# EAGLE board qc board V3 (EAGLE 9.6.1), part 1 of 3
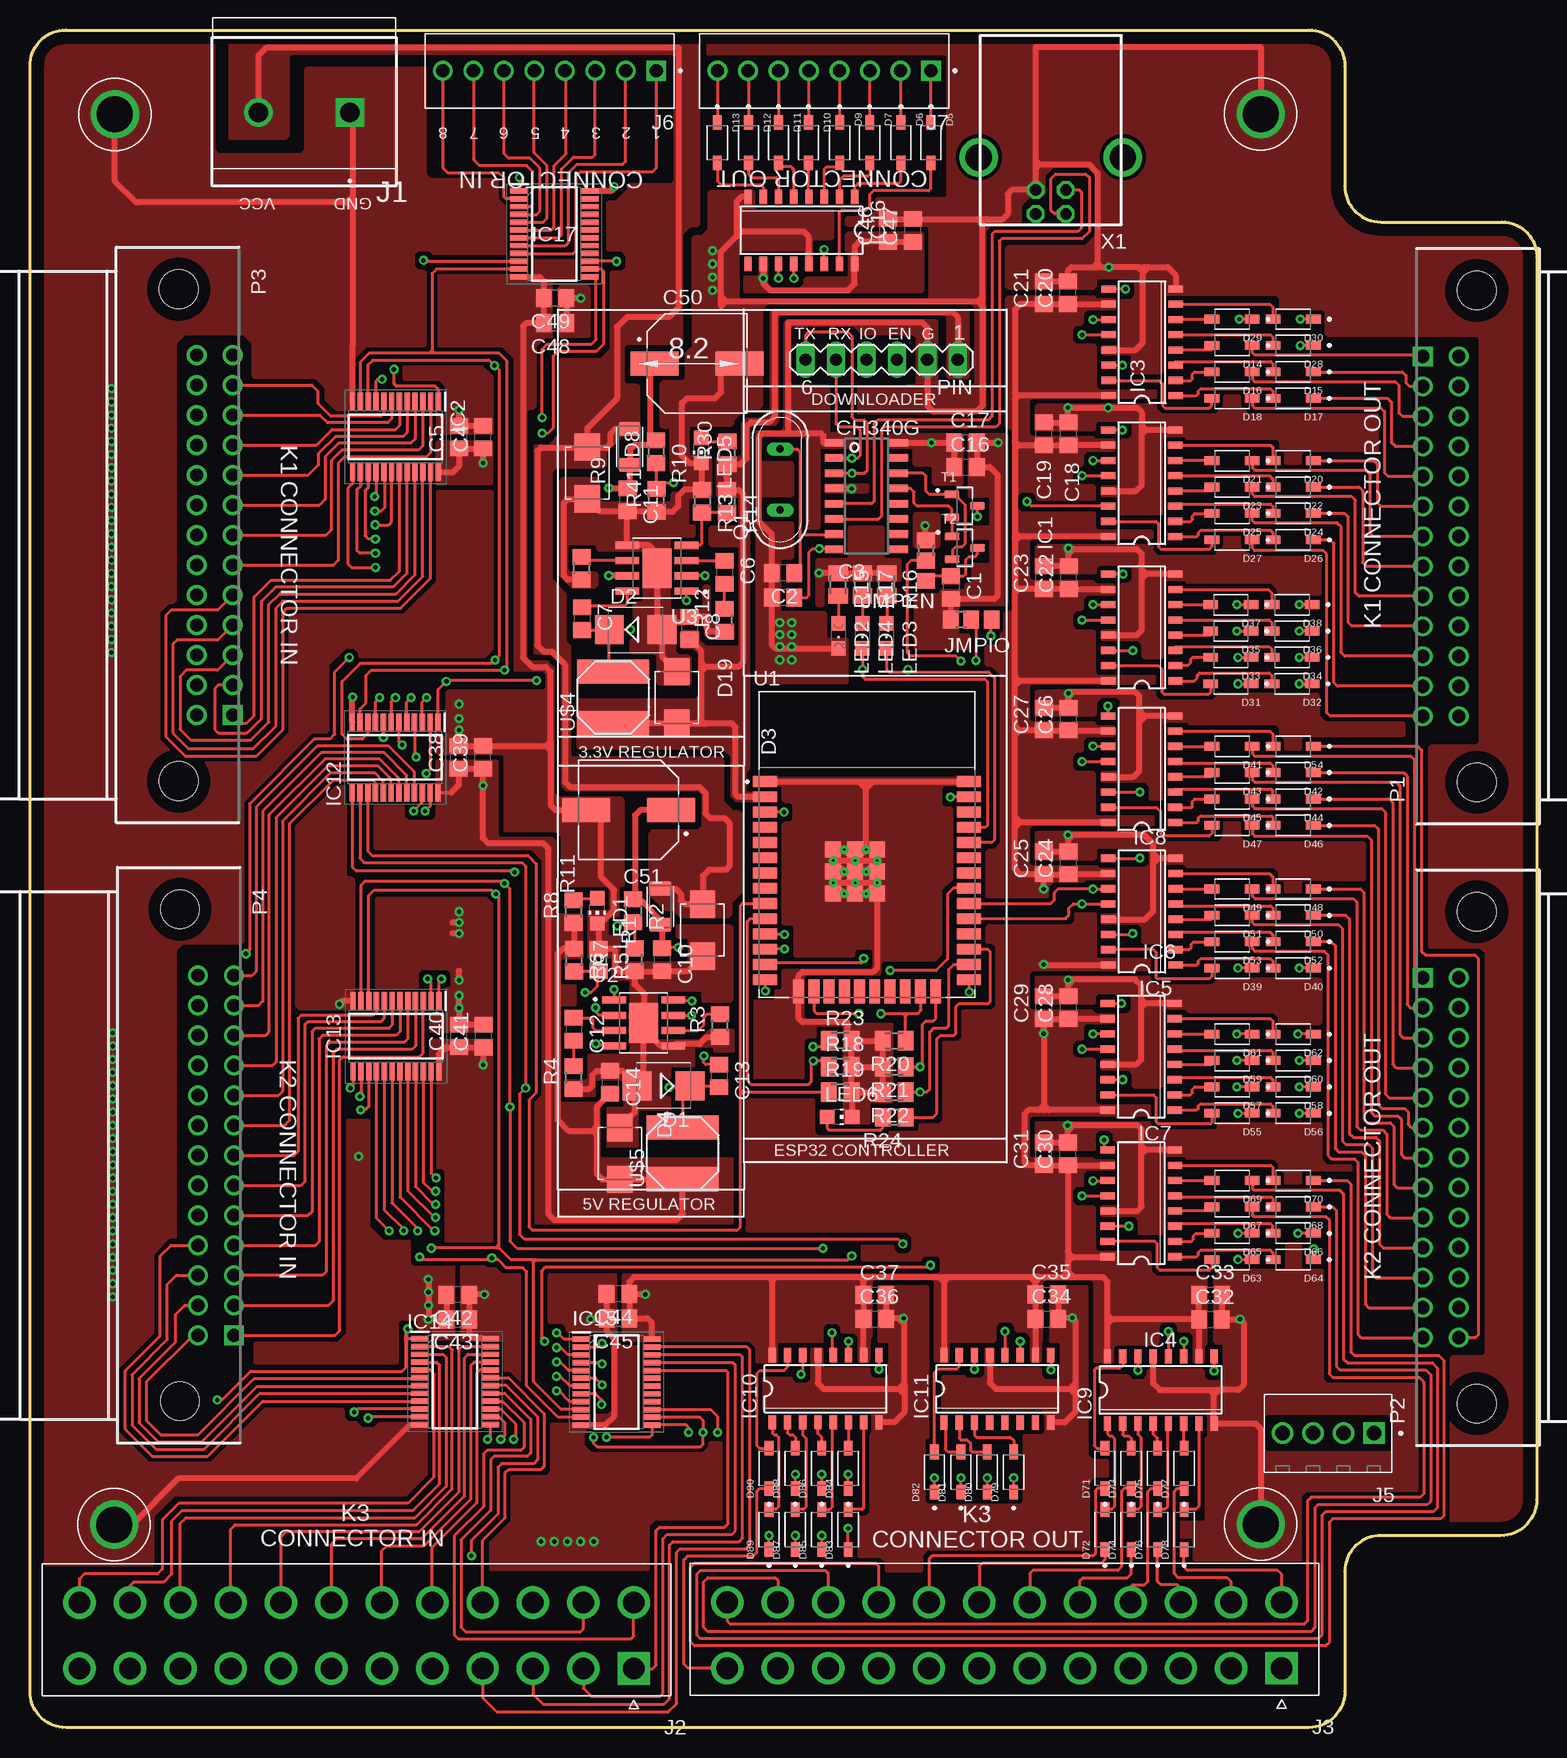
[diagram p1: board, top side]
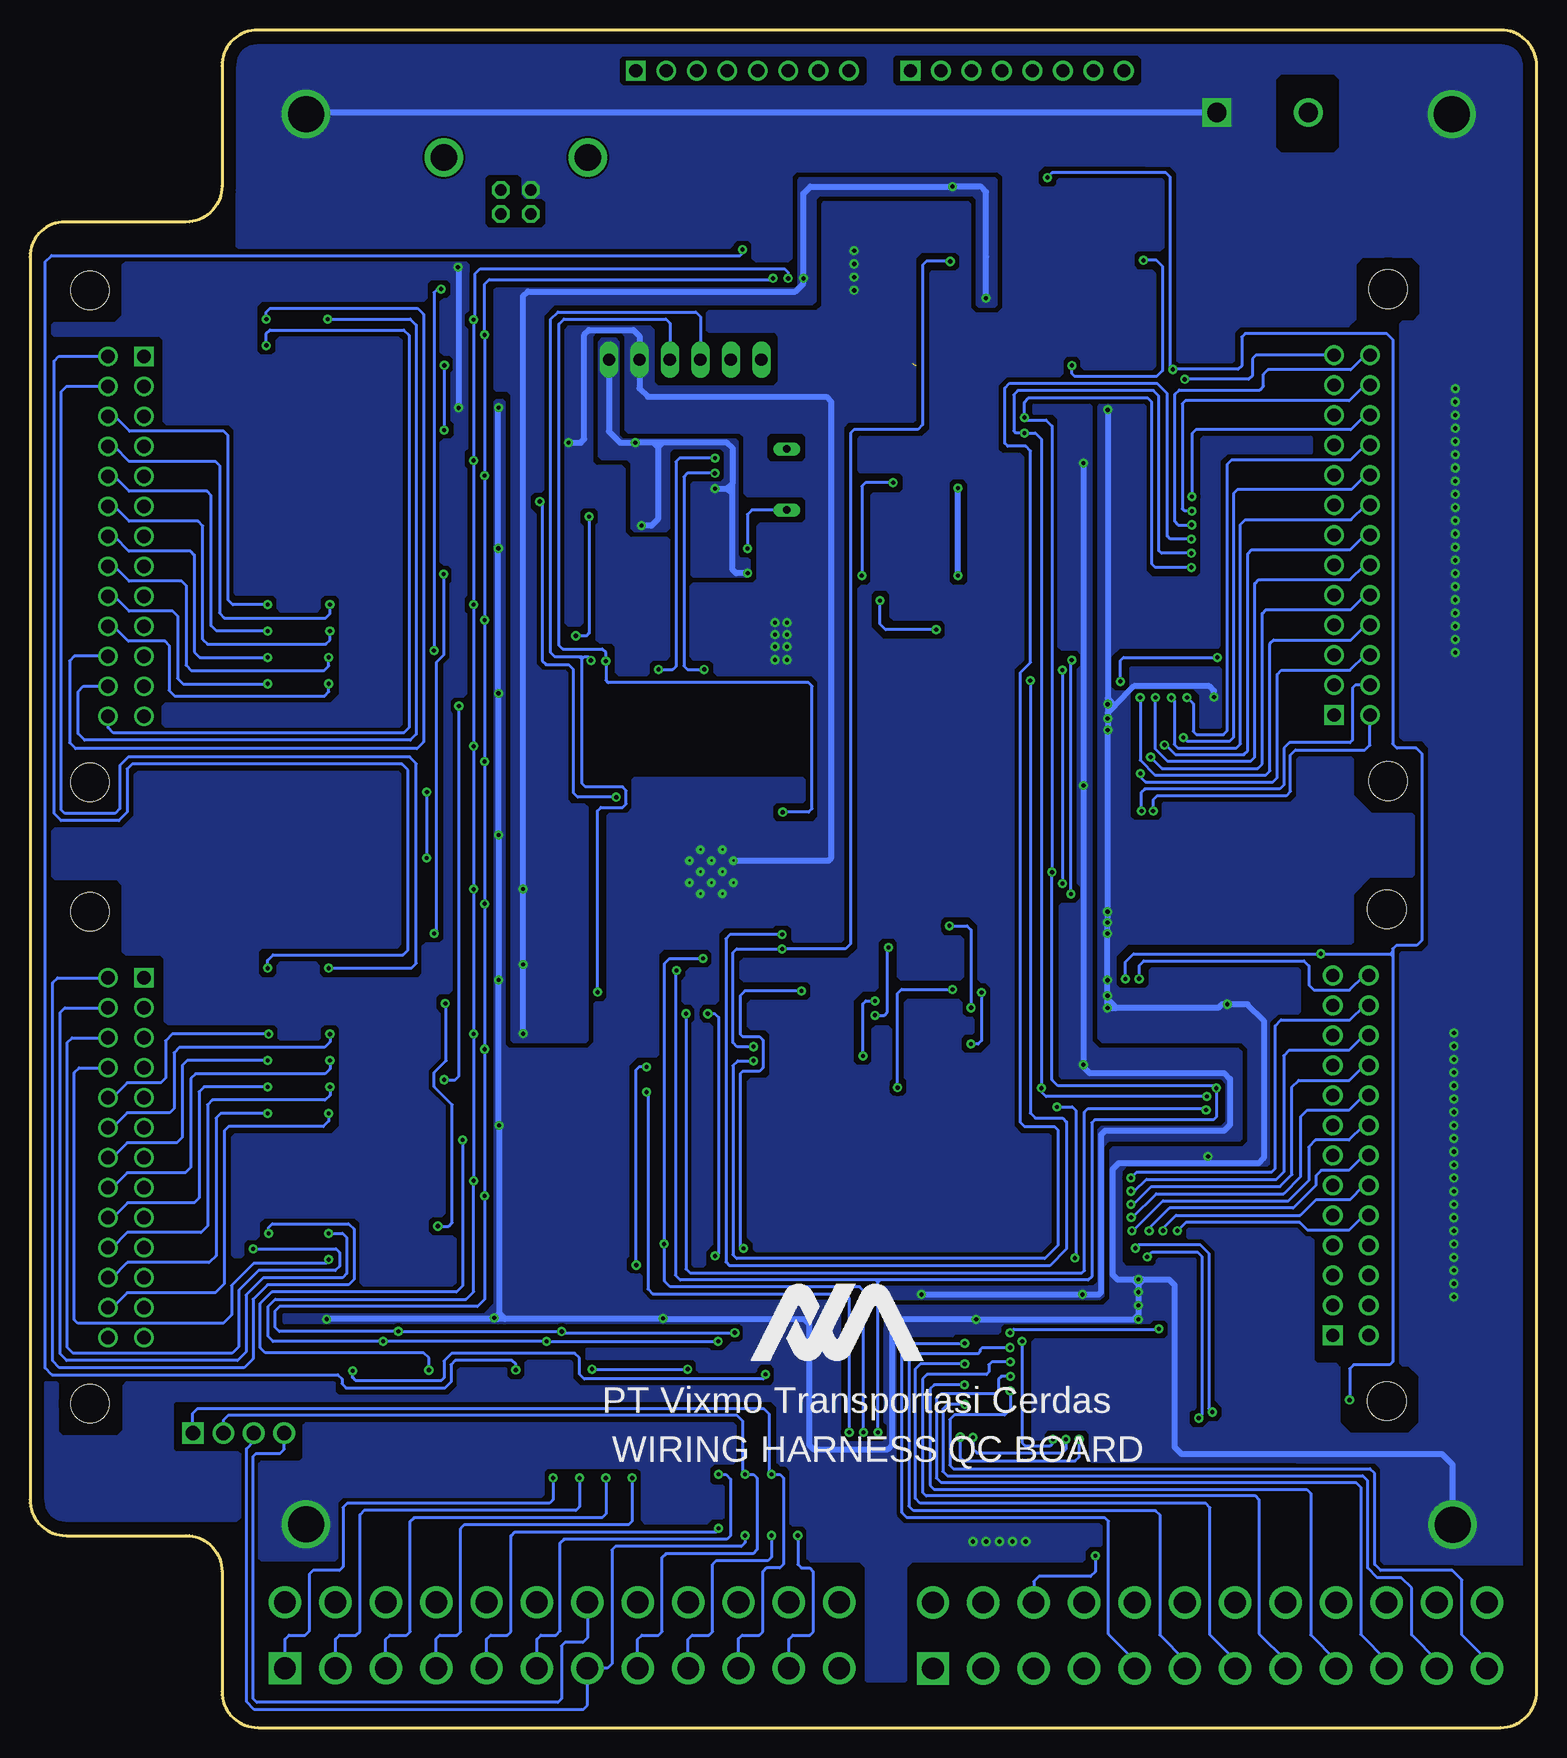
[diagram p2: board, bottom side, seen from below]

Size 125.6 x 141.5 mm. Coordinates in mm from the lower left corner, seen from the top.
Outline: 106.6,0 3,0 arc-90 0,3 0,138.5 arc-90 3,141.5 106.6,141.5 arc-90 109.6,138.5 109.6,128.5 arc90 112.6,125.5 122.7,125.5 arc-90 125.6,122.6 125.6,19 arc-90 122.6,16 112.6,16 arc90 109.6,13 109.6,3 arc-90 106.6,0
Copper layers (1*16): Top 0.035mm / dielectric 1.5mm / Bottom 0.035mm
Design rules "default *": minimum track width 6mil, minimum drill 0.35mm, track to track 6mil, track to pad 6mil, pad to pad 6mil, via to via 6mil, smd to smd 6mil, copper to edge 40mil, drill to drill 6mil, minimum pad ring 10mil, minimum via ring 8mil, stop-mask expansion 4mil, vias tented up to drill 14mil, thermal gap 10mil

## Footprints (pad centres in the part's own frame; a part is rotated, then mirrored left to right if it is on the bottom)
C0805 = smd 1.3 x 1.5: 1 -0.95,0; 2 0.95,0
CAP_EEEFT1V331GP = smd 4 x 2: 1 -3.55,0; 2 3.55,0
SMB = smd 2.4 x 2.4: A 2.2,0; C -2.2,0
DIOM4336X265N = smd 2.28 x 2.12: 1 -2.165,0; 2 2.165,0
SOD3715X145N = smd 1.21 x 0.73: A 1.68,0; C -1.68,0
SO16 = smd 0.6 x 1.2: 1 -4.445,-2.8; 2 -3.175,-2.8; 3 -1.905,-2.8; 4 -0.635,-2.8; 5 0.635,-2.8; 6 1.905,-2.8; 7 3.175,-2.8; 8 4.445,-2.8; 9 4.445,2.8; 10 3.175,2.8; 11 1.905,2.8; 12 0.635,2.8; 13 -0.635,2.8; 14 -1.905,2.8; 15 -3.175,2.8; 16 -4.445,2.8
SOP65P640X110-24N = smd 1.475 x 0.45: 1 -2.938,3.575; 2 -2.938,2.925; 3 -2.938,2.275; 4 -2.938,1.625; 5 -2.938,0.975; 6 -2.938,0.325; 7 -2.938,-0.325; 8 -2.938,-0.975; 9 -2.938,-1.625; 10 -2.938,-2.275; 11 -2.938,-2.925; 12 -2.938,-3.575; 13 2.938,-3.575; 14 2.938,-2.925; 15 2.938,-2.275; 16 2.938,-1.625; 17 2.938,-0.975; 18 2.938,-0.325; 19 2.938,0.325; 20 2.938,0.975; 21 2.938,1.625; 22 2.938,2.275; 23 2.938,2.925; 24 2.938,3.575
CUI_TB005-762-02BE = drill 1.6 square: 1 0,0 | drill 1.6: 2 7.62,0
MOLEX_39290243 = drill 1.8 pad 2.54 square: 1 0,0 | drill 1.8 pad 2.54: 2 4.2,0; 3 8.4,0; 4 12.6,0; 5 16.8,0; 6 21,0; 7 25.2,0; 8 29.4,0; 9 33.6,0; 10 37.8,0; 11 42,0; 12 46.2,0; 13 0,-5.5; 14 4.2,-5.5; 15 8.4,-5.5; 16 12.6,-5.5; 17 16.8,-5.5; 18 21,-5.5; 19 25.2,-5.5; 20 29.4,-5.5; 21 33.6,-5.5; 22 37.8,-5.5; 23 42,-5.5; 24 46.2,-5.5
TE_282834-4 = drill 1.2 square: 1 -3.81,0 | drill 1.2: 2 -1.27,0; 3 1.27,0; 4 3.81,0
PHOENIX_1725711 = drill 1.1 square: 1 1.5,3.1 | drill 1.1: 2 4.04,3.1; 3 6.58,3.1; 4 9.12,3.1; 5 11.66,3.1; 6 14.2,3.1; 7 16.74,3.1; 8 19.28,3.1
B0R-JMP = smd 1.5 x 1.3: 1 0,1.7; 2 0,0; 3 0,-1.7
CHIP-LED0805 = smd 1.2 x 1.2: A 0,-1.05; C 0,1.05
CHIPLED_0805 = smd 1.2 x 1.2: A 0,-1.05; C 0,1.05
JAE_MX23A26NF1 = drill 1.1 square: 1 15,4.5 | drill 1.1: 2 12.5,4.5; 3 10,4.5; 4 7.5,4.5; 5 5,4.5; 6 2.5,4.5; 7 0,4.5; 8 -2.5,4.5; 9 -5,4.5; 10 -7.5,4.5; 11 -10,4.5; 12 -12.5,4.5; 13 -15,4.5; 14 15,1.5; 15 12.5,1.5; 16 10,1.5; 17 7.5,1.5; 18 5,1.5; 19 2.5,1.5; 20 0,1.5; 21 -2.5,1.5; 22 -5,1.5; 23 -7.5,1.5; 24 -10,1.5; 25 -12.5,1.5; 26 -15,1.5 | hole 3.2: -20.5,0; 20.5,0
MA06-1 = drill 1.016 long: 1 -6.35,0; 2 -3.81,0; 3 -1.27,0; 4 1.27,0; 5 3.81,0; 6 6.35,0
QS = drill 0.61 long: 1 -2.54,0; 2 2.54,0
RESC3216X125N = smd 1.2 x 1.82: 1 -1.505,0; 2 1.505,0
R0805 = smd 1.3 x 1.5: 1 -0.95,0; 2 0.95,0
M0805 = smd 1.3 x 1.6: 1 -0.95,0; 2 0.95,0
SOT95P240X111-3N = smd 1.23 x 0.6: 1 -1.06,0.95; 2 -1.06,-0.95; 3 1.06,0
MODULE_ESP32-WROOM-32 = smd 2 x 0.9: 1 -8.5,5.26; 2 -8.5,3.99; 3 -8.5,2.72; 4 -8.5,1.45; 5 -8.5,0.18; 6 -8.5,-1.09; 7 -8.5,-2.36; 8 -8.5,-3.63; 9 -8.5,-4.9; 10 -8.5,-6.17; 11 -8.5,-7.44; 12 -8.5,-8.71; 13 -8.5,-9.98; 14 -8.5,-11.25; 25 8.5,-11.25; 26 8.5,-9.98; 27 8.5,-8.71; 28 8.5,-7.44; 29 8.5,-6.17; 30 8.5,-4.9; 31 8.5,-3.63; 32 8.5,-2.36; 33 8.5,-1.09; 34 8.5,0.18; 35 8.5,1.45; 36 8.5,2.72; 37 8.5,3.99; 38 8.5,5.26 | smd 0.9 x 2: 15 -5.715,-12.25; 16 -4.445,-12.25; 17 -3.175,-12.25; 18 -1.905,-12.25; 19 -0.635,-12.25; 20 0.635,-12.25; 21 1.905,-12.25; 22 3.175,-12.25; 23 4.445,-12.25; 24 5.715,-12.25 | smd 1.33 x 1.33: 39_1 -2.835,-0.405; 39_2 -1,-0.405; 39_3 0.835,-0.405; 39_4 -2.835,-2.24; 39_5 -1,-2.24; 39_6 0.835,-2.24; 39_7 -2.835,-4.075; 39_8 -1,-4.075; 39_9 0.835,-4.075 | drill 0.2 pad 0.3: 39_10 -1.917,-0.405; 39_11 -0.083,-0.405; 39_12 -2.835,-1.323; 39_13 -1,-1.323; 39_14 0.835,-1.323; 39_15 -1.917,-2.24; 39_16 -0.083,-2.24; 39_17 -2.835,-3.158; 39_18 -1,-3.158; 39_19 0.835,-3.158; 39_20 -1.917,-4.075; 39_21 -0.083,-4.075
SOIC127P600X170-9N = smd 1.97 x 0.6: 1 -2.475,1.905; 2 -2.475,0.635; 3 -2.475,-0.635; 4 -2.475,-1.905; 5 2.475,-1.905; 6 2.475,-0.635; 7 2.475,0.635; 8 2.475,1.905 | smd 2.41 x 3.3: 9 0,0
SOIC16 = smd 0.635 x 1.524: 1 -4.445,-2.695; 2 -3.175,-2.695; 3 -1.905,-2.695; 4 -0.635,-2.695; 5 0.635,-2.695; 6 1.905,-2.695; 7 3.175,-2.695; 8 4.445,-2.695; 9 4.445,2.695; 10 3.175,2.695; 11 1.905,2.695; 12 0.635,2.695; 13 -0.635,2.695; 14 -1.905,2.695; 15 -3.175,2.695; 16 -4.445,2.695
SRN6045 = smd 2.007 x 5.994: 1 -2.159,0; 2 2.159,0
PN61729 = drill 0.95 octagon: 1 1.25,4.71; 2 -1.25,4.71; 3 -1.25,2.71; 4 1.25,2.71 | drill 2.2: P$1 -6,0; P$2 6,0

## Placement (x,y rotation side)
C1  1uf  [C0805]  76.77,95.03 270 top
C2  22pf  [C0805]  62.77,96.22 180 top
C3  22pf  [C0805]  62.77,94.18 180 top
C4  100nf  [C0805]  37.78,107.56 90 top
C5  1uf  [C0805]  35.76,107.56 90 top
C6  220pf  [C0805]  57.9,96.3 270 top
C7  100nf  [C0805]  46.01,92.43 270 top
C8  22uf  [C0805]  54.99,91.64 270 top
C10  10uf  [C0805]  52.69,64 270 top
C11  10uf  [C0805]  49.81,102.33 270 top
C12  220pf  [C0805]  45.33,58.21 270 top
C13  100nf  [C0805]  57.45,54.31 270 top
C14  22uf  [C0805]  48.36,53.79 270 top
C16  100nf  [C0805]  77.99,105.07 0 top
C17  100nf  [C0805]  77.99,107.1 0 top
C18  1uf  [C0805]  86.56,107.84 90 top
C19  100nf  [C0805]  84.51,107.84 90 top
C20  1uf  [C0805]  86.53,119.6 90 top
C21  100nf  [C0805]  84.5,119.6 90 top
C22  1uf  [C0805]  86.59,95.85 90 top
C23  100nf  [C0805]  84.5,95.85 90 top
C24  1uf  [C0805]  86.55,72.07 90 top
C25  100nf  [C0805]  84.5,72.07 90 top
C26  1uf  [C0805]  86.55,84.06 90 top
C27  100nf  [C0805]  84.51,84.06 90 top
C28  1uf  [C0805]  86.55,60.01 90 top
C29  100nf  [C0805]  84.52,60.01 90 top
C30  1uf  [C0805]  86.51,47.82 90 top
C31  100nf  [C0805]  84.5,47.82 90 top
C32  1uf  [C0805]  98.4,34.02 0 top
C33  100nf  [C0805]  98.41,36.07 0 top
C34  1uf  [C0805]  84.76,34.06 0 top
C35  100nf  [C0805]  84.76,36.09 0 top
C36  1uf  [C0805]  70.43,34.05 0 top
C37  100nf  [C0805]  70.43,36.07 0 top
C38  1uf  [C0805]  35.73,80.88 90 top
C39  100nf  [C0805]  37.75,80.88 90 top
C40  1uf  [C0805]  35.76,57.65 90 top
C41  100nf  [C0805]  37.82,57.64 90 top
C42  100nf  [C0805]  35.67,36.08 180 top
C43  1uf  [C0805]  35.67,34.03 180 top
C44  100nf  [C0805]  49.01,36.15 180 top
C45  1uf  [C0805]  49.02,34.11 180 top
C46  1uf  [C0805]  71.5,124.8 90 top
C47  100nf  [C0805]  73.6,124.8 90 top
C48  100nf  [C0805]  43.77,117.05 180 top
C49  1uf  [C0805]  43.77,119.15 180 top
C50  EEEFT1V331GP  [CAP_EEEFT1V331GP]  55.6,113.7 0 top
C51  EEEFT1V331GP  [CAP_EEEFT1V331GP]  49.9,76.5 180 top
D1  ss34  [SMB]  52.81,53.49 180 top
D2  ss34  [SMB]  50.49,91.51 0 top
D3  SMBJ30CA  [DIOM4336X265N]  56.06,66.47 270 top
D4  SMBJ5.0CA  [DIOM4336X265N]  49.16,47.85 270 top
D5  1N5819HW-7  [SOD3715X145N]  75.1,132.1 270 top
D6  1N5819HW-7  [SOD3715X145N]  72.6,132.1 270 top
D7  1N5819HW-7  [SOD3715X145N]  70,132.1 270 top
D8  SMBJ30CA  [DIOM4336X265N]  46.47,104.57 270 top
D9  1N5819HW-7  [SOD3715X145N]  67.5,132.1 270 top
D10  1N5819HW-7  [SOD3715X145N]  64.9,132.1 270 top
D11  1N5819HW-7  [SOD3715X145N]  62.4,132.1 270 top
D12  1N5819HW-7  [SOD3715X145N]  59.9,132.1 270 top
D13  1N5819HW-7  [SOD3715X145N]  57.3,132.1 270 top
D14  1N5819HW-7  [SOD3715X145N]  100.2,115.2 180 top
D15  1N5819HW-7  [SOD3715X145N]  105.3,113 180 top
D16  1N5819HW-7  [SOD3715X145N]  100.2,113 180 top
D17  1N5819HW-7  [SOD3715X145N]  105.3,110.8 180 top
D18  1N5819HW-7  [SOD3715X145N]  100.2,110.8 180 top
D19  SMBJ3V3  [DIOM4336X265N]  53.92,85.86 270 top
D20  1N5819HW-7  [SOD3715X145N]  105.3,105.6 180 top
D21  1N5819HW-7  [SOD3715X145N]  100.2,105.6 180 top
D22  1N5819HW-7  [SOD3715X145N]  105.3,103.4 180 top
D23  1N5819HW-7  [SOD3715X145N]  100.2,103.4 180 top
D24  1N5819HW-7  [SOD3715X145N]  105.3,101.2 180 top
D25  1N5819HW-7  [SOD3715X145N]  100.2,101.2 180 top
D26  1N5819HW-7  [SOD3715X145N]  105.3,99 180 top
D27  1N5819HW-7  [SOD3715X145N]  100.2,99 180 top
D28  1N5819HW-7  [SOD3715X145N]  105.3,115.2 180 top
D29  1N5819HW-7  [SOD3715X145N]  100.2,117.4 180 top
D30  1N5819HW-7  [SOD3715X145N]  105.3,117.4 180 top
D31  1N5819HW-7  [SOD3715X145N]  100.1,87 180 top
D32  1N5819HW-7  [SOD3715X145N]  105.2,87 180 top
D33  1N5819HW-7  [SOD3715X145N]  100.1,89.2 180 top
D34  1N5819HW-7  [SOD3715X145N]  105.2,89.2 180 top
D35  1N5819HW-7  [SOD3715X145N]  100.1,91.4 180 top
D36  1N5819HW-7  [SOD3715X145N]  105.2,91.4 180 top
D37  1N5819HW-7  [SOD3715X145N]  100.1,93.6 180 top
D38  1N5819HW-7  [SOD3715X145N]  105.2,93.6 180 top
D39  1N5819HW-7  [SOD3715X145N]  100.2,63.3 180 top
D40  1N5819HW-7  [SOD3715X145N]  105.3,63.3 180 top
D41  1N5819HW-7  [SOD3715X145N]  100.2,81.8 180 top
D42  1N5819HW-7  [SOD3715X145N]  105.3,79.6 180 top
D43  1N5819HW-7  [SOD3715X145N]  100.2,79.6 180 top
D44  1N5819HW-7  [SOD3715X145N]  105.3,77.4 180 top
D45  1N5819HW-7  [SOD3715X145N]  100.2,77.4 180 top
D46  1N5819HW-7  [SOD3715X145N]  105.3,75.2 180 top
D47  1N5819HW-7  [SOD3715X145N]  100.2,75.2 180 top
D48  1N5819HW-7  [SOD3715X145N]  105.3,69.9 180 top
D49  1N5819HW-7  [SOD3715X145N]  100.2,69.9 180 top
D50  1N5819HW-7  [SOD3715X145N]  105.3,67.7 180 top
D51  1N5819HW-7  [SOD3715X145N]  100.2,67.7 180 top
D52  1N5819HW-7  [SOD3715X145N]  105.3,65.5 180 top
D53  1N5819HW-7  [SOD3715X145N]  100.2,65.5 180 top
D54  1N5819HW-7  [SOD3715X145N]  105.3,81.8 180 top
D55  1N5819HW-7  [SOD3715X145N]  100.2,51.2 180 top
D56  1N5819HW-7  [SOD3715X145N]  105.3,51.2 180 top
D57  1N5819HW-7  [SOD3715X145N]  100.2,53.4 180 top
D58  1N5819HW-7  [SOD3715X145N]  105.3,53.4 180 top
D59  1N5819HW-7  [SOD3715X145N]  100.2,55.6 180 top
D60  1N5819HW-7  [SOD3715X145N]  105.3,55.6 180 top
D61  1N5819HW-7  [SOD3715X145N]  100.2,57.8 180 top
D62  1N5819HW-7  [SOD3715X145N]  105.3,57.8 180 top
D63  1N5819HW-7  [SOD3715X145N]  100.2,39 180 top
D64  1N5819HW-7  [SOD3715X145N]  105.3,39 180 top
D65  1N5819HW-7  [SOD3715X145N]  100.2,41.2 180 top
D66  1N5819HW-7  [SOD3715X145N]  105.3,41.2 180 top
D67  1N5819HW-7  [SOD3715X145N]  100.2,43.4 180 top
D68  1N5819HW-7  [SOD3715X145N]  105.3,43.4 180 top
D69  1N5819HW-7  [SOD3715X145N]  100.2,45.6 180 top
D70  1N5819HW-7  [SOD3715X145N]  105.3,45.6 180 top
D71  1N5819HW-7  [SOD3715X145N]  89.6,21.6 90 top
D72  1N5819HW-7  [SOD3715X145N]  89.6,16.5 90 top
D73  1N5819HW-7  [SOD3715X145N]  91.8,21.6 90 top
D74  1N5819HW-7  [SOD3715X145N]  91.8,16.5 90 top
D75  1N5819HW-7  [SOD3715X145N]  94,21.6 90 top
D76  1N5819HW-7  [SOD3715X145N]  94,16.5 90 top
D77  1N5819HW-7  [SOD3715X145N]  96.2,21.6 90 top
D78  1N5819HW-7  [SOD3715X145N]  96.2,16.5 90 top
D79  1N5819HW-7  [SOD3715X145N]  82,21.3 90 top
D80  1N5819HW-7  [SOD3715X145N]  79.8,21.3 90 top
D81  1N5819HW-7  [SOD3715X145N]  77.6,21.3 90 top
D82  1N5819HW-7  [SOD3715X145N]  75.4,21.3 90 top
D83  1N5819HW-7  [SOD3715X145N]  68.2,16.5 90 top
D84  1N5819HW-7  [SOD3715X145N]  68.2,21.6 90 top
D85  1N5819HW-7  [SOD3715X145N]  66,16.5 90 top
D86  1N5819HW-7  [SOD3715X145N]  66,21.6 90 top
D87  1N5819HW-7  [SOD3715X145N]  63.8,16.5 90 top
D88  1N5819HW-7  [SOD3715X145N]  63.8,21.6 90 top
D89  1N5819HW-7  [SOD3715X145N]  61.6,16.5 90 top
D90  1N5819HW-7  [SOD3715X145N]  61.6,21.6 90 top
IC1  74HC595  [SO16]  92.67,103.71 90 top
IC2  74HC4067PW,118  [SOP65P640X110-24N]  30.47,107.58 270 top
IC3  74HC595  [SO16]  92.7,115.46 90 top
IC4  74HC595  [SO16]  92.68,91.69 90 top
IC5  74HC595  [SO16]  92.69,68.01 90 top
IC6  74HC595  [SO16]  92.67,79.88 90 top
IC7  74HC595  [SO16]  92.63,55.91 90 top
IC8  74HC595  [SO16]  92.64,43.69 90 top
IC9  74HC595  [SO16]  94.26,28.14 0 top
IC10  74HC595  [SO16]  66.32,28.24 0 top
IC11  74HC595  [SO16]  80.64,28.23 0 top
IC12  74HC4067PW,118  [SOP65P640X110-24N]  30.43,80.86 270 top
IC13  74HC4067PW,118  [SOP65P640X110-24N]  30.51,57.63 270 top
IC14  74HC4067PW,118  [SOP65P640X110-24N]  35.43,28.83 0 top
IC15  74HC4067PW,118  [SOP65P640X110-24N]  48.9,28.79 0 top
IC16  74HC595  [SO16]  64.3,124.8 180 top
IC17  74HC4067PW,118  [SOP65P640X110-24N]  43.7,124.5 0 top
J1  TB005-762-02BE  [CUI_TB005-762-02BE]  26.66,134.62 180 top
J2  39290243  [MOLEX_39290243]  50.33,4.91 180 top
J3  39290243  [MOLEX_39290243]  104.34,4.94 180 top
J5  282834-4  [TE_282834-4]  108.22,24.53 180 top
J6  1725711  [PHOENIX_1725711]  53.7,141.2 180 top
J7  1725711  [PHOENIX_1725711]  76.6,141.2 180 top
JMPEN  0R-JUMPB  [B0R-JMP]  74.69,97.27 180 top
JMPIO  0R-JUMPB  [B0R-JMP]  78.46,92.36 270 top
LED1  LED GREEN  [CHIP-LED0805]  47.29,68.07 180 top
LED2  LED RED  [CHIPLED_0805]  67.4,91 180 top
LED3  LED GREEN  [CHIPLED_0805]  71.4,91 180 top
LED4  LED BLUE  [CHIPLED_0805]  69.4,91 180 top
LED5  LED GREEN  [CHIP-LED0805]  55.96,106.45 180 top
LED6  LED RED  [CHIP-LED0805]  67.5,50.9 270 top
P1  MX23A26NF1  [JAE_MX23A26NF1]  120.6,99.3 90 top
P2  MX23A26NF1  [JAE_MX23A26NF1]  120.6,47.5 90 top
P3  MX23A26NF1  [JAE_MX23A26NF1]  12.4,99.4 270 top
P4  MX23A26NF1  [JAE_MX23A26NF1]  12.5,47.7 270 top
PIN  [MA06-1]  70.99,114.02 180 top
Q1  12MHz  [QS]  62.53,104.04 90 top
R1  0ZCJ0050FF2G  [RESC3216X125N]  52.54,68.42 90 top
R2  100k  [R0805]  50.29,68.08 270 top
R3  200k  [R0805]  57.53,58.51 90 top
R4  68.1k  [R0805]  45.33,54.17 90 top
R5  39k  [R0805]  47.38,63.98 270 top
R6  200k  [R0805]  45.34,63.97 270 top
R7  24.9k  [R0805]  50.38,63.99 90 top
R8  1k  [R0805]  45.33,68.01 90 top
R9  0ZCJ0050FF2G  [RESC3216X125N]  49.97,106.75 90 top
R10  100k  [R0805]  52.19,106.35 270 top
R11  200k  [R0805]  45.99,96.63 90 top
R12  68.1k  [R0805]  57.9,92.29 90 top
R13  39k  [R0805]  56.04,102.22 270 top
R14  120k  [R0805]  58.09,102.21 270 top
R15  1k  [M0805]  67.38,95.27 270 top
R16  1k  [M0805]  71.42,95.27 270 top
R17  1k  [M0805]  69.4,95.27 270 top
R18  10k  [M0805]  67.54,55.08 0 top
R19  10k  [M0805]  67.54,52.96 0 top
R20  10k  [M0805]  72.04,57.24 180 top
R21  10k  [M0805]  72.04,55.07 180 top
R22  10k  [M0805]  72.05,52.96 180 top
R23  10k  [M0805]  67.55,57.25 0 top
R24  330  [R0805]  72.05,50.85 180 top
R30  1k  [R0805]  58.13,106.25 90 top
R41  24.9k  [R0805]  52.23,102.29 90 top
T1  BSS138  [SOT95P240X111-3N]  77.91,101.83 0 top
T2  BSS138  [SOT95P240X111-3N]  77.93,98.33 0 top
U1  ESP32-WROOM-32  [MODULE_ESP32-WROOM-32]  69.79,73.59 0 top
U2  MP1584EN-LF-Z  [SOIC127P600X170-9N]  51.16,58.73 0 top
U3  MP1584EN-LF-Z  [SOIC127P600X170-9N]  52.26,96.64 180 top
U$3  CH340G  [SOIC16]  69.72,102.65 270 top
U$4  SRN6045-330M6045  [SRN6045]  48.61,85.87 90 top
U$5  SRN6045-330M6045  [SRN6045]  54.4,47.87 90 top
X1  [PN61729]  85.1,130.88 180 top

## Tracks (layer width: path | path; a pad name or v marks a point on that pad's centre or on a via)
3.3V  (via drill 0.35)
  Top 0.254: 55.92,84.2 56.4,83.72 56.4,83.7
  Top 0.508: C16.1 C17.1 v75.14,107.1 v75.13,107.09 U$3.16 | v74.62,100.18 74.62,99.05 JMPEN.3 | R16.1 R17.1 R15.1 v65.77,96.22 | v68.5,103.27 U$3.4 | U$4.1 53.9,83.71 D19.2 | C8.2 55.92,89.76 55.92,88.81 | D19.2 55.61,83.7 55.92,84.01 55.92,84.2 55.92,88.01 | 55.92,88.81 55.92,88.41 | 55.92,88.41 55.92,88.01 | 56.32,88.41 59.05,88.41 59.45,88.81 59.45,102.81 59.1,103.16 R14.1 58.09,105.26 R30.1 59.23,105.3 59.73,105.8 59.73,108.43 60.13,108.83 61.63,108.83 62.1,109.3 62.1,118 76.9,118 77.34,117.56 PIN.1 | 56.32,88.41 55.92,88.41 | 55.92,88.01 56.32,88.41 | 55.92,88.81 56.32,88.41 | D19.2 56.4,83.7 58.5,83.7 58.83,83.37 58.83,77.78 59.03,77.58 U1.2
  Bottom 0.508: v74.63,100.19 v74.62,100.18 v74.61,100.17 73.8,100.17 73.26,100.71 73.26,106.72 | 67.05,103.7 67.05,106.67 67.48,107.1 72.88,107.1 | 67.05,103.25 67.05,103.7 | 67.05,102.84 67.05,96.53 66.74,96.22 v65.77,96.22 | 67.05,102.84 67.05,103.25 | v68.5,103.27 67.48,103.27 | 67.48,103.27 67.07,103.27 67.05,103.25 | 67.05,102.84 67.48,103.27 | 67.48,103.27 67.05,103.7 | 73.26,106.72 73.64,107.1 | 73.26,106.72 72.88,107.1 | 73.64,107.1 v75.14,107.1 76.4,107.1 77.34,108.04 PIN.1 | 72.88,107.1 73.64,107.1
  pour Top (no thermals): 60.8,77.25 58.85,77.25 58.5,77.6 58.5,80.95 57.85,81.6 45.8,81.6 45.7,81.7 45.7,85.6 45.8,85.7 55.5,85.7 55.8,86 55.8,89.5 55.3,90 54.4,90 54.3,90.1 54.3,91.3 54.4,91.4 55.6,91.4 55.7,91.3 55.7,90.7 56.3,90.1 59.05,90.1 59.2,90.25 59.2,98.3 59,98.5 56.8,98.5 56.7,98.6 56.7,100 56.8,100.1 59.05,100.1 59.2,100.25 59.2,102.4 59,102.6 57.4,102.6 57.3,102.7 57.3,105.8 57.4,105.9 59.2,105.9 59.4,106.1 59.4,108.69 59.81,109.1 61.22,109.1 61.76,109.64 61.75,111.25 61.75,117.95 61.95,118.15 78.05,118.15 78.2,118 78.2,112.6 78.1,112.5 76.6,112.5 76.5,112.6 76.5,117.6 76.2,117.9 62.7,117.9 62.3,117.5 62.3,108.8 62.1,108.6 60.2,108.6 59.9,108.3 59.9,79.9 59.6,79.6 59.6,78.1 59.8,77.9 60.8,77.9
  pour Top (isolate 0.305, no thermals): 65.7,97.4 68.15,97.4 68.3,97.55 68.3,100.05 68.35,100.1 71.05,100.1 71.1,100.05 71.1,97.55 71.25,97.4 72.45,97.4 72.5,97.35 72.5,95.65 72.45,95.6 66.25,95.6 66.1,95.45 66.1,93.55 66.05,93.5 65.65,93.5 65.6,93.55 65.6,97.3
  pour Top (isolate 0.305, no thermals): 66.35,103.6 69.75,103.6 69.8,103.55 69.8,103 69.75,102.95 66.35,102.95
  pour Top (isolate 0.305, no thermals): 71.6,106.9 71.6,107.7 71.7,107.8 71.9,107.8 77.6,107.8 77.7,107.7 77.7,107.3 77.7,103.7 77.6,103.6 76.9,103.6 75.4,103.6 75.3,103.7 75.3,104 75.3,105 75.1,105.2 73.8,105.2 73.7,105.3 73.7,105.8 73.7,106.5 73.5,106.7 72.9,106.7 71.7,106.7 71.6,106.8
  pour Top (isolate 0.305, no thermals): 74,98.4 75.7,98.4 75.8,98.5 75.8,99.1 75.8,101.1 75.7,101.2 75.4,101.2 73.8,101.2 73.7,101.1 73.7,99.6 73.7,98.5 73.8,98.4
  pour Bottom (no thermals): 65.6,96.1 65.6,97.3 65.8,97.5 66.4,97.5 66.6,97.7 66.6,107.2 66.8,107.4 76.2,107.4 76.5,107.7 76.5,115.5 76.8,115.8 77.9,115.8 78.2,115.5 78.2,106 77.9,105.7 75.8,105.7 75.5,105.4 75.5,100 75.2,99.7 72.6,99.7 72.3,100 72.3,106.3 72,106.6 68,106.6 67.7,106.3 67.7,104.1 68,103.8 70.3,103.8 70.5,103.6 70.5,96.1 70.3,95.9 65.8,95.9
5V  (via drill 0.35)
  Top 0.254: IC12.24 35.11,77.92 | IC6.10 89.26,83.06 89.2,83.11
  Top 0.406: IC14.24 37.06,32.41 36.63,32.84
  Top 0.508: IC3.16 82.38,111.02 | C14.2 47.23,51.71 47.23,50.14 | 47.23,50.14 47.23,49.67 | 47.23,49.67 47.23,49.4 | 47.23,49.4 47.23,46.17 47.72,45.69 D4.2 54.37,45.69 U$5.1 54.4,42.82 53.88,42.3 43.7,42.3 43.2,42.8 43.2,73.3 42.8,73.7 38.2,73.7 37.77,74.13 v37.77,78.51 37.77,79.91 C39.1 37.73,79.9 35.71,79.9 C38.1 35.73,78.54 35.11,77.92 | 46.84,49.75 44.89,49.75 43.97,50.67 43.97,64.47 44.42,64.92 R6.1 R8.1 | 46.84,49.75 46.91,49.75 46.89,49.73 46.96,49.67 | 46.96,49.67 47.23,49.67 | 46.96,49.67 47.23,49.4 | 46.84,49.75 47.23,50.14 | C20.1 C21.1 82.55,118.65 82.1,118.2 82.1,111.3 | C20.1 89.89,118.65 IC3.10 | C19.1 C18.1 | IC1.10 C18.1 | 86.61,94.88 89.87,94.88 IC4.10 | 86.61,94.88 C22.1 C23.1 82.4,94.9 | 89.81,83.11 89.2,83.11 C26.1 C27.1 82.49,83.11 | C25.1 C24.1 | IC5.10 89.82,71.11 C24.1 | C29.1 C28.1 89.81,59.07 IC7.10 | C30.1 C31.1 83.13,46.87 82.9,47.1 82.9,51.12 83.24,51.47 84.06,51.47 | C30.1 IC8.10 | IC9.10 97.43,34.01 C32.1 | IC11.16 76.19,37.15 | IC10.16 61.88,37.23 | IC2.24 35.27,104.64 35.76,105.14 C5.1 C4.1 v37.78,105.4 | IC13.24 34.08,56.14 34.64,56.7 C40.1 C41.1 37.78,56.65 v37.78,55.25 | 36.63,32.84 C43.1 C42.1 v37.88,36.09 | IC15.24 51.84,33.75 51.48,34.11 C45.1 | C44.1 49.97,36.14 C45.1 | C44.1 50.02,36.09 v51.29,36.09 | C45.1 50.22,34.36 | C37.1 C36.1 69.48,31.05 IC10.10 | 69.46,36.09 C37.1 | IC11.10 C34.1 C35.1 83.81,37.14 | C32.1 C33.1 | C29.1 84.5,59.04 v84.5,57.84 | v84.5,69.89 C25.1 | C19.1 84.42,106.98 | 86.51,39.65 86.92,39.25 | C30.1 86.51,39.65 | C24.1 | 86.59,94.85 86.61,94.88 | C18.1 | C20.1 | v84.5,63.6 84.53,63.56 IC5.16 | 82.1,111.3 82.1,110.73 | 82.1,110.73 82.1,107.2 | 82.41,106.89 C19.1 | 82.1,107.2 82.41,106.89
  Top 0.508: 82.1,107.2 82.1,106.6 | 82.1,106.6 82.1,99.6 | 82.1,99.6 82.1,99.2 | 82.1,99.2 82.1,98.9 | 82.1,98.9 82.1,95.2 | 82.1,95.2 82.1,94.6 | 82.41,106.89 82.39,106.89 82.1,106.6 | 82.1,83.5 82.1,86.9 | 82.1,86.9 82.1,87.3 | 82.1,87.3 82.1,87.6 | 82.1,87.6 82.1,94.6 | 82.49,83.11 82.1,83.5 | 82.4,94.9 82.1,94.6 | 82.4,94.9 82.1,95.2 | 82.1,99.2 82.16,99.27 82.44,99.27 | IC1.16 82.47,99.27 | 82.44,99.27 82.47,99.27 | 82.44,99.27 82.1,99.6 | 82.47,99.27 82.1,98.9 | 82.1,111.3 82.38,111.02 | 82.38,111.02 82.1,110.73 | C25.1 82.58,71.12 82.1,71.6 82.1,75 | 82.1,75 82.1,75.9 | 82.1,75.9 82.1,82.72 | 82.1,82.72 82.1,83.5 | 82.49,83.11 82.1,82.72 | C29.1 84.5,59.06 84.5,51.9 | 84.5,51.47 84.5,51.9 | IC4.16 82.5,87.24 | 82.45,87.24 82.16,87.24 82.1,87.3 | 82.45,87.24 82.5,87.24 | 82.45,87.24 82.1,87.6 | 82.5,87.24 82.16,86.9 82.1,86.9 | IC6.16 82.56,75.44 | 82.56,75.44 82.1,75.9 | 82.56,75.44 82.53,75.44 82.1,75 | IC7.16 84.94,51.47 | 84.94,51.47 84.5,51.47 | C44.1 49.96,37.16 50.35,37.55 61.55,37.55 | 61.55,37.55 62.2,37.55 | 62.2,37.55 69.16,37.55 | 69.16,37.55 69.8,37.55 | 84.2,37.55 83.81,37.55 | C37.1 69.48,37.23 | 69.48,37.23 69.8,37.55 | 69.48,37.23 69.16,37.55 | 83.81,37.16 83.81,37.55 | 61.88,37.23 62.2,37.55 | 61.88,37.23 61.55,37.55 | 84.5,51.47 84.06,51.47 | 84.94,51.47 84.5,51.9 | 84.5,51.9 84.06,51.47 | C47.1 C46.1 69.15,123.85 68.74,123.44 IC16.16 68.74,120.34 68.2,119.8 61.7,119.8 61.12,120.38 v61.12,120.8 IC16.10 | C48.1 C49.1 v45.91,119.15 | 75.79,37.55 76.19,37.15 | 69.8,37.55 75.79,37.55 | 75.79,37.55 76.6,37.55 | 76.6,37.55 83.4,37.55 | 83.4,37.55 83.81,37.55 | 76.19,37.15 76.6,37.55 | 83.81,37.16 83.81,37.14 | 83.81,37.16 84.2,37.55 | 83.81,37.14 83.4,37.55
  Top 0.508: 86.51,39.65 86.51,38.84 | 86.51,38.84 86.92,39.25 | 86.92,39.25 IC8.16 | 84.2,37.55 86.06,37.55 | 86.06,37.55 86.51,37.55 | 86.51,37.55 86.96,37.55 | 86.96,37.55 89.43,37.55 89.81,37.16 89.81,34.41 | v48.7,128.45 48.7,128.3 48.47,128.08 IC17.24 | IC9.16 89.81,33.64 | 89.81,33.64 89.81,34.02 | 89.81,34.02 89.81,34.41 | C32.1 90.2,34.02 | 90.2,34.02 89.81,34.02 | 90.2,34.02 89.81,34.41 | 90.2,34.02 89.81,33.64 | 86.51,38.84 86.51,38 | 86.51,38 86.51,37.55 | 86.06,37.55 86.51,38 | 86.51,38 86.96,37.55
  Bottom 0.508: v37.78,105.4 v37.78,78.52 | v37.78,78.52 v37.77,78.51 | v37.78,78.52 v37.78,55.25 37.78,55.06 37.27,54.55 26.05,54.55 25.57,54.07 25.57,50.23 26.07,49.73 35.99,49.73 36.29,49.43 36.29,36.31 36.51,36.09 v37.88,36.09 | 38.7,36.09 v37.88,36.09 | v51.29,36.09 v37.88,36.09 | v84.5,57.84 v84.5,63.6 v84.5,69.89 84.5,119.3 84.1,119.7 61.8,119.7 61.12,120.38 v61.12,120.8 61.12,127.88 60.55,128.45 v48.7,128.45 46.35,128.45 45.9,128 45.9,122.6 45.91,122.61 v45.91,119.15
  pour Top (isolate 0.305, no thermals): 60.85,121.15 60.85,122.5 60.9,122.55 61.35,122.55 61.4,122.5 61.4,120.35 61.8,119.95 64.2,119.95 64.6,120.35 64.6,120.7 64.75,120.85 68.15,120.85 68.3,121 68.3,122.85 68.05,123.1 68.05,124.45 68.2,124.6 74.35,124.6 74.4,124.55 74.4,119.75 74.3,119.65 59.65,119.65 59.6,119.7 59.6,120.9 59.65,120.95 60.65,120.95
  pour Top (isolate 0.305, no thermals): 44.25,120.15 46.45,120.15 46.6,120 46.6,116 46.55,115.95 44.15,115.95 44.1,116 44.1,120
  pour Top (isolate 0.305, no thermals): 43.8,68 43.8,73.9 43.5,74.2 39.15,74.2 39,74.35 39,80.55 38.95,80.6 33.9,80.6 33.85,80.55 33.85,75.9 33.55,75.6 31.5,75.6 31.2,75.9 31.2,76.7 31.1,76.8 28.8,76.8 28.7,76.7 28.7,73.3 28.8,73.2 41.8,73.2 42.7,72.3 42.7,52.7 42.1,52.1 42.1,42.1 42.2,42 58.5,42 58.6,42.1 58.6,47.45 58.55,47.5 47.6,47.5 47.5,47.6 47.5,52.1 44.35,52.1 44.1,52.35 44.1,60 44.3,60.2 45.45,60.2 45.5,60.25 45.5,61.85 45.45,61.9 44.3,61.9 44.1,62.1 44.1,63.85 44.35,64.1 46,64.1 46.05,64.15 46.05,67.75 46,67.8 44,67.8
  pour Top (isolate 0.305, no thermals): 34.65,40.5 38.55,40.5 38.6,40.55 38.6,57.3 38.55,57.35 33.35,57.35 33.3,57.3 33.3,55.9 33.35,55.85 33.9,55.85 33.9,46.65 33.95,46.6 34.4,46.6 34.6,46.4 34.6,40.55
  pour Top (no thermals): 35.35,107.25 38.45,107.25 38.55,107.15 38.55,106.65 38.55,103.7 38.45,103.6 33.95,103.6 33.85,103.7 33.85,107.15 33.95,107.25
  pour Top (no thermals): 39.43,32.24 35.99,32.24 35.9,32.33 35.9,38.42 35.98,38.5 37.9,38.5 38.1,38.3 38.81,38.3 39.31,37.8 40.8,37.8 40.9,37.7 40.9,28.86 40.06,29.7 39.58,29.7 39.5,29.78 39.5,32.17
  pour Top (no thermals): 49.4,37.7 49.4,32.3 49.5,32.2 60,32.2 60.5,31.7 60.5,30.5 60.6,30.4 62.2,30.4 62.3,30.5 62.3,32 62.4,32.1 66,32.1 66.1,32.2 66.1,33.4 66.4,33.7 67.3,33.7 67.6,33.4 67.6,33 67.7,32.9 68.7,32.9 69,32.6 69,30.6 69.1,30.5 69.9,30.5 70,30.6 70,32.4 70.2,32.6 70.2,37.2 70.4,37.4 70.4,37.8 49.5,37.8
  pour Top (isolate 0.305, no thermals): 76.5,30.5 75.5,30.5 75.4,30.6 75.4,37.2 75.2,37.4 70.3,37.4 70.3,37.8 75.7,37.8 75.9,38 75.9,39.1 75.7,39.3 74.5,39.3 74.3,39.1 74.3,39 74.2,38.9 69.4,38.9 69.3,39 69.3,40.1 69.4,40.2 71.9,40.2 72,40.1 72,39.8 72.3,39.5 73.2,39.5 73.5,39.8 73.5,40.9 73.1,41.3 59.9,41.3 59.7,41.5 59.7,52.3 59.8,52.4 65.3,52.4 65.4,52.3 65.4,49.6 65.7,49.3 71.5,49.3 71.6,49.4 71.6,49.6 71.7,49.7 74,49.7 74.1,49.8 74.1,50.2 74.2,50.3 75.8,50.3 76.1,50.6 76.1,57.1 76.2,57.2 77.4,57.2 77.7,57.5 77.7,59.7 77.8,59.8 80.2,59.8 80.5,60.1 80.5,65.1 80.2,65.4 79.8,65.4 79.7,65.5 79.7,66.7 79.9,66.9 86.8,66.9 87.1,67.2 87.1,67.8 87.2,67.9 88.8,67.9 88.9,67.8 88.9,64.2 89,64.1 93.3,64.1 93.4,64 93.4,63.2 93.3,63.1 83.5,63.1 83.3,62.9 83.3,60 83.5,59.8 88.5,59.8 88.8,59.5 90.3,59.5 90.4,59.4 90.4,58.8 90.3,58.7 88,58.7 87.8,58.5 87.8,57.4 87.7,57.3 87.2,57.3 86.9,57 86.9,56.1 87.2,55.8 88.6,55.8 88.8,55.6 88.8,52.1 89,51.9 93.3,51.9 93.4,51.8 93.4,51.1 93.3,51 83.5,51 83.3,50.8 83.3,47.6 83.4,47.5 88.6,47.5 88.8,47.3 90.3,47.3 90.4,47.2 90.4,46.6 90.3,46.5 88.1,46.5 87.8,46.2 87.8,45.2 87.7,45.1 87.2,45.1 86.9,44.8 86.9,43.8 87.2,43.5 88.6,43.5 88.8,43.3 88.8,39.9 89,39.7 93.3,39.7 93.5,39.5 93.5,38 93.9,37.6 98,37.6 98.1,37.5 98.1,32 97.9,31.8 97.9,30.5 97.8,30.4 97.1,30.4 97,30.5 97,32.7 96.7,33 95.8,33 95.7,33.1 95.7,33.5 95.4,33.8 94.4,33.8 94.1,33.5 94.1,32.1 93.9,31.9 90.5,31.9 90.3,31.7 90.3,30.5 90.2,30.4 88.8,30.4 88.7,30.5 88.7,37.1 88.5,37.3 84.6,37.3 84.4,37.1 84.4,32.2 84.3,32.1 84.3,30.6 84.2,30.5 83.5,30.5 83.4,30.6 83.4,32.6 83,33 82.3,33 82.1,33.2 82.1,33.5 81.8,33.8 80.8,33.8 80.5,33.5 80.5,32.3 80.3,32.1 76.7,32.1 76.6,32 76.6,30.6
  pour Top (isolate 0.305, no thermals): 87.8,70.5 85.3,70.5 84.9,70.1 84.9,69.3 84.8,69.2 79.8,69.2 79.7,69.3 79.7,73 79.9,73.2 80.4,73.2 80.9,73.7 80.9,87.8 80.2,88.5 79.8,88.5 79.6,88.7 79.6,90 79.8,90.2 80.6,90.2 80.9,90.5 80.9,91.1 81.2,91.4 81.2,92.9 81.3,93 81.7,93 81.9,93.2 81.9,108.1 81.7,108.3 81.5,108.3 81.3,108.5 81.3,119.1 81.5,119.3 88.7,119.3 88.9,119.1 90.4,119.1 90.5,119 90.5,118.3 90.4,118.2 88.1,118.2 87.8,117.9 87.8,117.1 87.6,116.9 87.2,116.9 86.9,116.6 86.9,115.6 87.2,115.3 88.7,115.3 88.9,115.1 88.9,111.7 89.1,111.5 93.8,111.5 93.9,111.4 93.9,110.9 93.8,110.8 83.5,110.8 83.3,110.6 83.3,107.8 83.5,107.6 88.6,107.6 88.8,107.4 90.3,107.4 90.4,107.3 90.4,106.5 90.3,106.4 88.1,106.4 87.8,106.1 87.8,105.3 87.6,105.1 87.2,105.1 86.9,104.8 86.9,104 87.3,103.6 88.6,103.6 88.8,103.4 88.8,102.4 88.7,102.3 84,102.3 83.9,102.4 83.9,102.7 83.6,103 82.6,103 82.3,102.7 82.3,101.6 82.6,101.3 88.7,101.3 88.8,101.2 88.8,100 89,99.8 93.5,99.8 93.6,99.7 93.6,99.2 93.5,99.1 83.5,99.1 83.3,98.9 83.3,95.8 83.5,95.6 88.6,95.6 88.9,95.3 90.3,95.3 90.4,95.2 90.4,94.5 90.3,94.4 88.1,94.4 87.8,94.1 87.8,93.3 87.6,93.1 87.2,93.1 86.9,92.8 86.9,91.8 87.2,91.5 88.6,91.5 88.8,91.3 88.8,87.9 89,87.7 93.7,87.7 93.8,87.6 93.8,87.1 93.7,87 83.5,87 83.3,86.8 83.3,84 83.5,83.8 88.7,83.8 89,83.5 90.3,83.5 90.4,83.4 90.4,82.7 90.3,82.6 88.1,82.6 87.8,82.3 87.8,81.5 87.6,81.3 87.2,81.3 86.9,81 86.9,80 87.2,79.7 88.6,79.7 88.8,79.5 88.8,76.1 88.9,76 93.6,76 93.7,75.9 93.7,75.3 93.6,75.2 83.5,75.2 83.3,75 83.3,72 83.5,71.8 88.9,71.8 89.1,71.6 90.3,71.6 90.4,71.5 90.4,70.8 90.3,70.7 88,70.7
  pour Bottom (isolate 0.305, no thermals): 36.1,36.8 36.1,36 36.4,35.7 54.3,35.7 54.4,35.8 54.4,36.7 54.3,36.8
  pour Bottom (isolate 0.305, no thermals): 37.1,36.8 36.9,36.8 36.6,37.1 36.6,49.8 36.3,50.1 26.3,50.1 25.9,50.5 25.9,53.7 26.3,54.1 39.6,54.1 39.8,54.3 39.8,68.5 39.6,68.7 38.4,68.7 38,69.1 38,70.1 38.3,70.4 38.3,88.2 38,88.5 38,89.5 38.3,89.8 39.6,89.8 39.9,90.1 39.9,109.1 40.3,109.5 41.9,109.5 42,109.6 42,110.2 41.9,110.3 37.3,110.3 37.1,110.1 37.1,57.2 36.5,56.6 24.9,56.6 24.6,56.3 24.6,49.1 24.8,48.9 35.7,48.9 36.1,48.5 36.1,36 36.4,35.7 37.1,35.7
  pour Bottom (no thermals): 79.3,57.1 85.3,57.1 85.5,57.3 85.5,111.1 85.8,111.4 86.7,111.4 86.9,111.6 86.9,119.8 86.7,120 61.8,120 61.6,120.2 61.6,129 61.4,129.2 45.2,129.2 45,129 45,118.6 45.2,118.4 46.5,118.4 46.7,118.6 46.7,127.4 47,127.7 59.8,127.7 60.1,127.4 60.1,118.9 60.4,118.6 81.9,118.6 82.8,117.7 82.8,103.2 83,103 83.6,103 83.9,102.7 83.9,101.6 83.4,101.1 83.4,88.6 82.9,88.1 81,88.1 80.8,87.9 80.8,77.3 80.5,77 79.4,77 79.1,76.7 79.1,57.3
24V
  Top 0.508: R1.2 53.83,69.92 54.27,69.48 54.27,68.93 54.56,68.64 D3.1 56.1,68.64 56.1,71 56.6,71.5 58,71.5 58.3,71.8 58.3,75.4 57.9,75.8 56.7,75.8 56.3,76.2 56.3,77.9 55.8,78.4 45,78.4 44.6,78.8 44.6,88.6 43.5,89.7 42.8,89.7 42.3,90.2 42.3,106.4 42.6,106.7 46.78,106.7 46.8,106.68 | D8.1 46.52,106.68 46.8,106.68 | 46.8,106.68 48.07,106.68 48.4,107.01 48.4,107.87 48.78,108.25 R9.2 | J1.2 19.04,139.34 19.7,140 54.1,140 54.1,118.4 53.3,117.6 49.8,117.6 48.93,116.73 48.93,110.77 46.47,108.31 D8.1 | D8.1 46.5,106.77
  pour Top (isolate 0.305, no thermals): 16.7,132.4 21.3,132.4 21.6,132.7 21.6,139.3 21.8,139.5 53.55,139.5 53.7,139.35 53.7,128.9 53.5,128.7 50,128.7 49.8,128.5 49.8,128.2 48.85,127.25 48.25,127.25 48.1,127.1 48.1,123.2 48.2,123.1 49.3,123.1 49.7,122.7 49.7,121.7 49.4,121.4 48.5,121.4 48.4,121.3 48.4,114.9 47.6,114.1 44.3,114.1 44.2,114 44.2,107.85 43.25,106.9 42.1,106.9 42,106.8 42,89.6 42.1,89.5 43.4,89.5 44.3,88.6 44.3,78.5 44.7,78.1 55.7,78.1 56,77.8 56,75.1 55.7,74.8 51.9,74.8 51.6,74.5 51.6,69.5 53,68.1 53.7,68.1 54.26,67.54 58.24,67.54 58.5,67.8 58.5,68.8 59.3,69.6 59.3,76.2 59.1,76.4 58.6,76.4 57.8,77.2 57.8,80.6 57.5,80.9 45.2,80.9 45.05,81.05 45.05,90.15 44.7,90.5 44.7,94.5 43.5,95.7 43.5,104.7 43.8,105 47.8,105 48,105.2 48,106.3 49.4,107.7 50.7,107.7 50.8,107.8 50.8,111.8 50.6,112 49.7,112 49.5,112.2 49.5,115.1 49.7,115.3 54.1,115.3 54.4,115.6 54.4,124.5 55,125.1 55.6,125.1 55.8,125.3 55.8,140.5 55.5,140.8 16.8,140.8 16.6,140.6 16.6,132.5
D+
  Top 0.254: U$3.5 70.16,102.01 70.4,102.25 70.4,108.75 70.65,109 79.9,109 80.2,109.3 80.2,124.5 80.4,124.7 87.35,124.7 87.65,125 87.65,128 87.48,128.17 X1.3
D-
  Top 0.254: U$3.6 70.74,100.74 71,101 71,108.15 71.25,108.4 80.5,108.4 80.8,108.7 80.8,123.9 81,124.1 87.7,124.1 88.3,124.7 88.3,129.2 88,129.5 85.5,129.5 85.1,129.1 85.1,126.5 85.43,126.17 X1.2
DS  (via drill 0.35)
  Top 0.254: IC1.14 83.49,101.8 v83.1,102.2 | U1.37 78.26,77.55 v76.73,77.55
  Bottom 0.254: v76.73,77.55 79.95,77.55 80.3,77.9 80.3,88.2 80.7,88.6 82.6,88.6 82.9,88.9 82.9,102 v83.1,102.2
DTR
  Top 0.254: T2.1 76.85,99.3 T1.2 76.85,101.55 76.6,101.8 73.95,101.8 73.7,102.05 73.7,103 73.41,103.28 U$3.13
EN
  Top 0.254: JMPEN.1 74.7,95.98 C1.1 77.83,95.98 78,96.15 78,97.35 78.25,97.6 78.75,97.6 78.99,97.84 T2.3
EN_MUX_1  (via drill 0.35)
  Top 0.254: IC2.15 28.19,103.33 27.93,103.07 27.93,99.34 28.2,99.07 v28.79,99.07 | R18.1 66.09,55.58 v65.3,55.58 65.1,55.38 65.1,53.8 64.88,53.58 60.12,53.58 59.8,53.9 59.8,67.2 60.02,67.42 U1.10
  Bottom 0.254: v28.79,99.07 30.57,99.07 30.8,99.3 30.8,111.2 31.65,112.05 43.95,112.05 44.35,111.65 44.35,107.05 44.1,106.8 42.6,106.8 42.2,106.4 42.2,88.78 43.07,87.91 43.07,50.47 42.7,50.1 40.2,50.1 39.9,49.8 39.9,40.2 41,39.1 66.7,39.1 67,39.4 67,55.18 66.6,55.58 v65.3,55.58
EN_MUX_2
  Top 0.254: IC12.15 28.16,73.05 28.5,72.7 41.5,72.7 42.2,72 42.2,52.9 41.6,52.3 41.6,41.74 41.91,41.43 58.93,41.43 59.2,41.7 59.2,52.72 | R19.1 59.44,52.96 | 59.44,52.96 59.2,53.2 | 59.2,53.2 59.2,68.5 59.39,68.69 U1.9 | 59.2,53.2 59.2,52.72 | 59.44,52.96 59.2,52.72
EN_MUX_3  (via drill 0.35)
  Top 0.254: IC13.15 28.23,51.77 27.96,51.49 v27.56,51.49 | U1.23 74.23,59.73 74,59.5 73.2,59.5 | 73.2,59.5 v70.92,59.5 72.78,59.5 72.99,59.29 | R20.1 72.99,59.29 | 72.99,59.29 73.2,59.5
  Bottom 0.254: v27.56,51.49 27.67,51.6 37.4,51.6 37.7,51.3 37.7,38.1 37.9,37.9 70.6,37.9 70.92,38.22 v70.92,59.5
EN_MUX_4  (via drill 0.35)
  Top 0.254: IC14.15 39.23,26.55 40.49,25.3 40.49,24.19 v40.33,24.03 | v42.9,32.2 42.63,32.47 42.63,38.03 42.94,38.34 74.82,38.34 74.86,38.34 v75.06,38.54 | R21.1 v74.2,55.07 74.4,55.27 74.4,58.6 74.7,58.9 75.3,58.9 75.5,59.11 U1.24
  Bottom 0.254: v40.33,24.03 40.33,23.72 40.55,23.5 42.65,23.5 42.9,23.75 v42.9,32.2 | v74.2,55.07 74.83,55.07 75.1,54.8 75.1,38.58 v75.06,38.54
EN_MUX_5  (via drill 0.35)
  Top 0.254: IC15.15 56.72,26.52 57.31,25.93 v57.31,24.61 | U1.26 77.01,63.61 76.6,63.2 76.6,58.5 76.4,58.3 75.3,58.3 75,58 75,53.2 74.76,52.96 v74.2,52.96 R22.1
  Bottom 0.254: v57.31,24.61 57.31,35.8 57.67,36.16 73.7,36.16 74.1,36.56 74.1,52.86 v74.2,52.96
EN_MUX_6  (via drill 0.35)
  Top 0.254: v48.89,122.21 48.88,122.22 IC17.15 | U1.12 61.27,64.9 v62.9,64.9 | R23.1 66.6,56.85 66.5,56.75 v65.28,56.75
  Bottom 0.254: v48.89,122.21 50.89,122.21 51.2,121.9 51.2,108.6 51.6,108.2 56.9,108.2 57.2,107.9 57.2,65.33 57.63,64.9 v62.9,64.9 66.7,64.9 67,64.6 67,57.1 66.65,56.75 v65.28,56.75
ESP_EN  (via drill 0.35)
  Top 0.254: JMPEN.2 73.44,97.27 73.15,96.98 73.15,89.55 73.4,89.3 77.2,89.3 v77.6,88.9 | v62.85,76.3 U1.3
  Bottom 0.254: PIN.3 72.26,117.06 72.6,117.4 81.1,117.4 81.5,117 81.5,90.2 81.2,89.9 77.9,89.9 77.6,89.6 v77.6,88.9 77.6,87.3 77.4,87.1 60.7,87.1 60.4,86.8 60.4,76.6 60.7,76.3 v62.85,76.3
ESP_IO  (via drill 0.35)
  Top 0.254: U1.25 v78.29,61.31 v78.3,61.3 | JMPIO.2 78.84,91.98 v78.84,88.95
  Bottom 0.254: PIN.4 69.72,117.62 70.1,118 81.6,118 82.2,117.4 82.2,89.6 81.85,89.25 79.8,89.25 | 79.6,89.25 79.4,89.25 | 79.6,89.25 79.8,89.25 | v78.3,61.3 78.3,76.4 78,76.7 76.2,76.7 75.9,77 75.9,78.1 76.2,78.4 79.3,78.4 79.6,78.7 79.6,89.25 | 79.4,89.25 79.6,89.05 79.8,89.25 | v78.84,88.95 78.84,89.05 79.04,89.25 79.4,89.25
ESP_RX  (via drill 0.35)
  Top 0.254: U$3.2 68.48,105.83 v68.5,105.81 68.98,105.81 69.2,106.03 69.2,108.2 68.97,108.42 67.42,108.42 67.18,108.67 PIN.5 | LED3.C 71.4,88.2 71.6,88 73,88 | 73.4,88 79.9,88 80.4,87.5 80.4,74 80.17,73.77 U1.34 | 73,88 73.4,88 | 73,88 v73.2,88.2 73.4,88
  Bottom 0.254: v68.5,105.81 71.46,105.81 71.75,105.52 71.75,88.45 72,88.2 v73.2,88.2
ESP_TX  (via drill 0.35)
  Top 0.254: U$3.3 v68.5,104.55 v68.51,104.55 69.57,104.55 69.8,104.78 69.8,108.75 69.55,109 68.75,109 68.5,109.25 68.5,116 68.2,116.3 64.9,116.3 64.64,116.04 PIN.6 | LED4.C v69.4,88.2 69.4,87.6 69.6,87.4 79.6,87.4 79.8,87.2 79.8,75.2 79.64,75.04 U1.35
  Bottom 0.254: v68.51,104.55 70.8,104.55 71.1,104.25 71.1,88.5 70.8,88.2 v69.4,88.2
ESPLED
  Top 0.254: U1.27 79.82,64.88 80,64.7 80,60.5 79.8,60.3 77.4,60.3 77.2,60.1 77.2,57.9 77,57.7 75.9,57.7 75.6,57.4 75.6,51.2 75.25,50.85 R24.1
GND  (via drill 0.35, 3)
  Top 0.254: U1.39_11 U1.39_3 | U1.39_15 U1.39_18 | U1.39_16 U1.39_19 | U1.39_16 U1.39_5 | U1.39_2 U1.39_10 U1.39_1 | U1.39_16 U1.39_6 | U1.39_17 U1.39_4 | U1.39_20 U1.39_7
  Top 0.406: 47.95,25.21 IC15.12 | 27.19,20.76 31.69,25.26 IC14.12 | IC17.12 42.47,120.92
  Top 0.508: C20.2 86.56,120.58 | IC3.13 90.5,114.83 90.52,114.81 | 89.89,114.81 IC3.13 | 84.39,108.91 C19.2 C18.2 86.53,108.82 v86.53,110.01 v89.87,110.01 v89.88,110 92.3,110 92.67,109.63 92.67,108.5 | 63.2,107.86 65.94,107.86 66.15,107.65 66.15,107.09 U$3.1 | 63.2,107.86 61.03,107.86 60.73,107.56 60.73,100.57 61.82,99.48 C2.2 C3.2 61.82,90.28 62.15,89.95 LED2.C | C11.2 52.19,101.38 R41.1 53.58,101.34 54.05,101.81 54.05,102.68 54.58,103.21 56,103.21 R13.1 56.04,105.32 LED5.C 54.96,105.4 54.35,106.01 54.35,110.4 54.75,110.8 57.1,110.8 57.61,111.31 57.61,113.7 | C11.2 49.78,101.36 U3.5 51.6,98.55 52.26,97.89 U3.9 52.26,91.94 D2.A | D2.A 53.34,92.16 54.56,92.16 C8.1 55.01,92.61 56.25,92.61 56.45,92.41 56.45,91.51 56.62,91.34 R12.1 | D2.A 52.69,89.25 D19.1 | U2.9 51.16,58.23 51.84,57.55 51.84,57.53 52.55,56.83 U2.5 53.78,56.97 55.81,56.97 56.4,57.56 R3.1 | R7.1 C10.2 | C10.2 | R7.1 49.12,63.04 48.79,63.37 48.79,64.72 48.58,64.93 R5.1 47.38,66.93 LED1.C 47.56,67.02 48.7,68.16 48.7,69.8 47.6,70.9 47.6,74.6 47.6,75.1 47.6,76 47.1,76.5 C51.2 46.1,76.5 43.8,76.5 43.41,76.89 43.41,81.5 | R4.1 46.6,53.22 46.89,53.51 46.89,54.38 47.25,54.74 C14.1 49.36,54.74 D1.A | D4.1 50.41,51.27 50.41,53.29 D1.A | R7.1 50.38,61.96 51.17,61.17 U2.9 | D1.A 51.16,54.04 U2.9 | C11.2 47.49,101.38 D8.2 44.8,102.4 44.5,102.1 44.5,96 44.81,95.69 R11.1 | D3.2 54.8,63.04 C10.2 | R3.1 57.55,57.58 | U1.1 69.12,78.85 | 69.12,78.85 69.78,78.85 | C21.2 C20.2 | C20.2 86.53,120.8 | IC3.13 92.17,114.83 92.76,115.42 92.76,121.27 | 95.48,108.16 IC1.8 93.02,108.16 | 92.37,121.73 v89.93,121.73 89.91,121.75 89.3,121.75
  Top 0.508: 92.37,121.73 92.89,121.73 | 92.89,121.73 93.22,121.73 | 93.22,121.73 94.84,121.73 95.51,121.06 95.51,119.91 IC3.8 | C23.2 C22.2 86.56,96.83 86.56,97.8 | IC1.13 92.2,103.08 92.67,103.54 92.67,107.8 | IC4.13 92.26,91.05 92.68,91.48 92.68,95.77 | C27.2 C26.2 86.55,85.9 86.55,85.91 | IC6.13 91.96,79.25 92.46,79.74 92.46,83.8 | C25.2 C24.2 86.55,74 | IC5.13 92.93,67.38 93.64,68.08 93.64,72.03 | C29.2 C28.2 86.55,61.91 | 87,62.36 92.12,62.36 92.64,61.84 92.64,60.7 | IC7.13 92.24,55.28 92.64,55.67 92.64,60.01 | C31.2 C30.2 86.51,49.7 | IC8.8 92.99,48.14 | IC8.13 92.3,43.05 92.66,43.42 92.66,47.8 | 69.78,78.85 70.27,78.85 | 70.27,78.85 U1.38 | 69.79,78.42 69.79,78.37 70.27,78.85 | 69.79,78.42 69.79,78.84 69.78,78.85 | 69.79,78.42 69.75,78.42 69.71,78.46 69.71,78.26 | 69.71,78.26 69.12,78.85 | IC9.13 93.62,28.68 94.17,28.13 98.3,28.13 | C35.2 C34.2 85.79,34.14 v86.89,34.14 87.14,33.89 87.14,28.68 | 87.14,28.68 87.14,27.79 | 87.14,27.79 87.14,26.3 86.27,25.43 IC11.8 | IC11.13 80,28.73 80.52,28.21 86.67,28.21 | IC10.8 72.05,25.44 72.88,26.27 72.88,27.79 | IC10.13 65.69,28.7 66.16,28.22 72.42,28.22 | C42.2 C43.2 v33.21,34.03 | C41.2 C40.2 v35.77,59.99 v35.77,61 | v33.21,34.03 | C44.2 48.06,34.12 C45.2 | C45.2 48.07,33.05 48.67,32.45 48.67,25.93 47.95,25.21 | v35.76,83.15 35.73,83.12 C38.2 C39.2 43.03,81.83 | v35.76,109.84 C5.2 C4.2 | IC13.12 26.08,60.57 v25.8,60.29 | v46.73,34.03 47.99,34.03 C45.2 | 72.88,28.68 72.88,33.61 | 72.88,28.68 72.88,28.22 | 72.42,28.22 72.45,28.22 | 72.45,28.22 72.88,28.22 | C36.2 C37.2 | C36.2 71.41,34.02 | 72.88,28.22 72.88,27.79 | 72.45,28.22 72.88,27.79 | 72.42,28.22 72.88,28.68 | 87.14,27.79 86.72,28.21 86.67,28.21
  Top 0.508: 86.67,28.21 87.14,28.68 | C32.2 C33.2 | 98.3,28.13 98.8,28.13 | 98.8,28.13 99.1,28.13 | 99.1,28.13 100.73,28.13 101.17,28.58 101.17,33.73 v100.87,34.03 v100.86,34.02 C32.2 | 92.46,83.8 92.46,84.8 | 92.46,84.8 92.46,86 92.16,86.3 86.95,86.3 | 92.68,95.77 92.68,96.5 | 92.68,96.5 92.68,97.82 92.27,98.23 86.99,98.23 | 92.67,107.8 92.67,108.5 | 92.89,121.73 92.76,121.6 92.76,121.34 | 92.76,121.27 92.76,121.34 | 93.64,72.03 93.64,72.45 94.04,72.45 | 92.76,121.27 93.22,121.73 | 92.76,121.34 92.37,121.73 | IC5.8 94.06,72.45 | 93.64,72.36 93.64,72.86 | 93.64,72.86 93.64,73.64 92.85,74.43 86.98,74.43 | 94.06,72.45 94.04,72.45 | 94.04,72.45 93.64,72.86 | 94.06,72.45 93.64,72.03 | IC12.12 26.86,85.86 v26.9,85.9 | 88.7,121.75 86.83,121.75 86.53,121.45 C20.2 | JMPIO.3 76.76,93.66 77.2,94.1 80.4,94.1 80.67,94.37 80.67,104.41 80.01,105.07 C16.2 C17.2 v80.7,107.1 | C32.2 99.57,34.02 | 86.56,97.8 86.99,98.23 | 86.99,98.23 86.62,98.23 | 86.62,98.23 v86.56,98.29 | 86.56,97.8 86.56,98.17 86.62,98.23 | 86.55,85.91 86.95,86.3 | 86.55,85.91 v86.55,86.2 86.65,86.3 86.95,86.3 | 86.98,74.43 86.55,74 | 86.98,74.43 86.58,74.43 v86.54,74.39 86.55,74.37 86.55,74 | 86.55,61.91 87,62.36 | 87,62.36 86.58,62.36 v86.55,62.33 | v86.55,62.33 | 86.55,61.91 v86.55,62.33 | 87.03,50.22 86.51,49.7 | 87.03,50.22 92.31,50.22 92.66,49.87 92.66,48.47 | 87.03,50.22 86.52,50.22 v86.51,50.21 | v86.51,50.21 v86.5,50.2 | 86.51,49.7 v86.51,50.21 | 72.43,34.06 72.88,33.61 | 72.88,33.61 72.88,34.06 v72.83,34.11 71.44,34.11 C36.2 | 92.99,48.14 92.66,47.8 | 92.66,47.8 92.66,48.47 | 92.66,48.47 92.99,48.14 | IC6.8 92.98,84.33 | 92.98,84.33 92.46,83.8 | 92.98,84.33 92.93,84.33 92.46,84.8
  Top 0.508: IC4.8 93.05,96.13 | 92.68,96.5 93.05,96.13 | 93.05,96.13 92.68,95.77 | 92.67,107.8 93.02,108.16 | 93.02,108.16 92.67,108.5 | 79.4,118.5 79.4,110.2 78.9,109.7 75.3,109.7 74.8,110.2 PIN.2 74.8,116.7 74.4,117.1 63.2,117.1 63.2,107.86 | 79,118.9 79.4,118.5 | 79.1,125.75 C47.2 C46.2 | 79.1,125.75 79.7,125.75 | 79.7,125.75 81.1,125.75 81.5,126.15 81.5,127.8 81.87,128.17 X1.4 83.85,130 | 98.7,27.73 IC9.8 102.16,25.34 102.6,24.9 v102.6,16.95 | 98.7,27.73 98.7,28.04 98.8,28.13 | 98.7,27.73 | 98.7,27.73 99.1,28.13 | 98.7,27.73 98.3,28.13 | IC16.8 59.3,127.6 58.9,127.2 58.9,125.1 | 58.9,125.1 58.9,124.3 | IC16.13 64.94,124.27 64.5,124.7 59.3,124.7 | 59.3,124.7 58.9,124.3 | 59.3,124.7 58.9,125.1 | 26.9,115.2 26.89,115.19 | IC2.12 26.89,115.19 | 83.85,130 83.85,130.6 | 83.85,130.6 83.85,140.1 102.6,140.1 v102.6,134.5 | 27.19,20.76 12.35,20.76 8.51,16.91 v7.01,16.91 | R3.1 57.33,57.56 | 42.47,120.92 42.82,120.58 C49.2 C48.2 41.35,117.05 41.1,116.8 41.1,89.2 41.9,88.4 43,88.4 43.41,88 43.41,82.2 | 43.03,81.83 43.41,82.2 | 26.39,127.13 8.86,127.13 7.08,128.91 v7.08,134.47 | 26.89,126.62 26.39,127.13 | J1.1 26.89,134.38 26.89,127.61 | 26.89,127.61 26.89,126.62 | 26.89,126.62 26.89,115.19 | 26.39,127.13 26.41,127.13 26.89,127.61 | 58.9,124.3 57.62,123.02 57.62,119.3 | 57.62,119.3 57.62,118.5 58.02,118.9 | 58.02,118.9 57.62,119.3 | 58.02,118.9 79,118.9 | 69.71,78.26 U1.39_11 U1.39_13 | U1.39_8 U1.39_21 | U1.39_21 U1.39_19 U1.39_18 U1.39_17 | U1.39_20 U1.39_17 | U1.39_17 U1.39_15 U1.39_12 U1.39_13 | U1.39_16 U1.39_14 U1.39_13 | U1.39_13 U1.39_10 | R19.2 R22.2 71.1,55.06 R21.2 | R18.2 R21.2 | R23.2 R20.2 | R20.2 | R19.2 R18.2 | R18.2 68.49,57.24 R23.2
  Top 0.508: R21.2 R20.2 | R23.2 68.1,57.65 68.1,58.8 64.4,58.8 64.08,59.12 U1.15 64.08,62.67 64.4,63 70.3,63 70.62,63.33 U1.39_9 U1.39_21 | 43.41,82.2 43.41,81.5 | 43.03,81.83 43.08,81.83 43.41,81.5 | 79.4,118.5 79.4,119.3 | 79.4,119.3 79.4,125.45 | 79.4,125.45 79.7,125.75 | 79.4,125.45 79.1,125.75 | 79,118.9 79.4,119.3 | 92.64,60.01 92.64,60.7 | IC7.8 92.98,60.36 | 92.98,60.36 92.64,60.7 | 92.98,60.36 92.64,60.01 | 83.85,130 84.15,130.3 | 88.7,121.75 89,122.05 | 84.15,130.3 88.3,130.3 89,129.6 89,122.05 | 88.7,121.75 89.3,121.75 | 89,122.05 89.3,121.75 | 84.15,130.3 83.85,130.6 | LED6.C 68.55,52.9 R19.2 | v33.2,37.35 33.21,37.34 v33.21,36.3 v33.21,35.2 v33.21,34.03 | v35.77,68 35.7,68 | v35.77,67.1 35.2,67.1 | v35.77,66.2 35.2,66.2 | v35.77,62.3 35.77,63.07 35.8,63.1 | v35.76,84.1 35.7,84.1 | v35.76,85.3 35.8,85.3
  Bottom 0.254: v102.6,16.95 102.6,17 103.4,17
  Bottom 0.508: 35.77,60.71 v35.77,61 v35.77,62.3 v35.77,66.2 v35.77,67.1 v35.77,68 v35.77,83.14 v35.76,83.15 v35.76,84.1 35.76,84.6 | v35.76,109.84 35.76,85.8 | 35.76,85.8 v35.76,85.3 35.76,84.6 | 33.63,37.35 34.95,37.35 35.37,37.77 35.37,46.53 34.86,47.04 23.17,47.04 22.75,47.46 22.75,58.93 24.11,60.29 v25.8,60.29 26.24,60.29 26.55,59.98 35.04,59.98 35.05,59.99 | 33.63,37.35 33.21,36.93 | 33.21,36.93 33.2,36.92 v33.2,36.3 | 35.05,59.99 35.77,60.71 | 35.77,60.71 v35.77,59.99 35.05,59.99 | 33.58,34.03 v46.73,34.03 46.75,34.05 52.9,34.05 53.7,33.25 53.7,23.6 54.1,23.2 60.3,23.2 60.66,23.56 60.66,33.65 61.06,34.05 72.77,34.05 v72.83,34.11 72.88,34.06 86,34.06 | 32.79,37.35 30.65,37.35 30.19,36.89 30.19,23.39 29.61,22.81 7.91,22.81 7.01,21.91 v7.01,16.91 | 32.79,37.35 v33.2,37.35 | v33.2,37.35 33.63,37.35 | 33.21,36.93 33.02,37.12 | 33.02,37.12 32.79,37.35 | 33.58,34.03 33.2,34.41 | v33.2,36.3 v33.2,35.2 | v33.2,35.2 33.2,34.41 | 33.2,34.41 v33.2,34.04 v33.21,34.03 33.58,34.03 | 86.57,34.07 86.58,34.06 | 86.97,34.06 v86.89,34.14 | 86,34.06 86.58,34.06 | 86.58,34.06 86.97,34.06 | v100.87,34.03 100.85,34.06 86.97,34.06 | v86.53,110.01 86.56,109.98 v86.56,98.29 86.62,98.26 86.58,98.26 86.56,98.24 v86.56,86.21 v86.55,86.2 v86.55,74.39 v86.54,74.39 86.55,74.38 v86.55,62.33 v86.55,62.32 86.55,50.25 v86.5,50.2 86.5,34.56 | v26.9,85.9 26.9,86.4 27.3,86.8 33.56,86.8 35.16,85.2 | 35.76,84.6 35.16,85.2 | 35.76,85.8 35.16,85.2 | v86.89,34.14 v86.89,34.15 | v89.93,121.73 89.88,121.68 v89.88,110 | v80.7,107.1 79.7,107.1 79.4,107.4 79.4,116.1 79,116.5 75.3,116.5 74.8,116 PIN.2 74.8,111.62 74.1,110.92 59.22,110.92 58.8,110.5 58.8,72.5 59.03,72.27 U1.39_12
  Bottom 0.508: 86.5,34.53 86.5,34.26 | J1.1 102.48,134.62 v102.6,134.5 | 86.5,34.56 86,34.06 | 86.5,34.56 86.5,34.53 | 86.5,34.53 v86.89,34.14 | 33.02,37.12 33.2,37.3 v33.2,37.35 | v33.21,36.3 v33.2,36.3 | v33.2,35.2 v33.21,35.2
  other vias: 6.9,57.9 6.9,56.8 6.9,55.7 6.9,54.6 6.9,53.5 6.9,52.4 6.9,51.3 6.9,50.2 6.9,49.1 6.9,48 6.9,46.9 6.9,45.8 6.9,44.7 6.9,43.6 6.9,42.5 6.9,41.4 6.9,40.3 6.9,39.2 6.9,38.1 6.9,37 6.9,35.9 6.8,111.6 6.8,110.5 6.8,109.4 6.8,108.3 6.8,107.2 6.8,106.1 6.8,105 6.8,103.9 6.8,102.8 6.8,101.7 6.8,100.6 6.8,99.5 6.8,98.4 6.8,97.3 6.8,96.2 6.8,95.1 6.8,94 6.8,92.9 6.8,91.8 6.8,90.7 6.8,89.6 63.5,89 62.5,89 63.5,90.1 62.5,90.1 63.5,91.1 62.5,91.1 63.5,92.1 62.5,92.1 27.4,47.6 56.9,119.8 56.9,120.9 56.9,122 56.9,123.1 42.6,15.5 43.7,15.5 44.8,15.5 45.9,15.5 47,15.5
  pour Top (isolate 0.305, no thermals): 52.45,87 54.95,87 55.05,87.1 55.05,89.15 54.9,89.3 54.1,89.3 53.77,89.63 53.77,91.77 54.05,92.05 55.9,92.05 56.3,91.65 56.3,91.05 56.55,90.8 58.65,90.8 58.65,91.9 56.95,91.9 56.65,92.2 56.65,95.05 56.55,95.15 56.25,95.15 56.15,95.05 56.15,93.3 55.95,93.1 53.55,93.1 53.35,93.3 53.35,99.15 53.5,99.3 55.3,99.3 55.4,99.4 55.4,100.1 55.35,100.15 55,100.15 54.85,100.3 54.85,102.4 55,102.55 56.7,102.55 56.75,102.6 56.75,105.85 56.65,105.95 55.05,105.95 54.9,106.1 54.9,108.35 55.1,108.55 58.45,108.55 58.59,108.69 58.59,108.98 59.49,109.88 60.73,109.88 61.02,110.17 61.02,118.95 55.25,118.95 55.25,115.1 54.7,114.55 54.7,112.4 54.5,112.2 52.75,112.2 52.55,112 52.55,108.55 52.7,108.4 53.2,108.4 53.4,108.2 53.4,104.7 53.5,104.6 54.15,104.6 54.5,104.25 54.5,103.35 54.05,102.9 53.6,102.9 53.5,102.8 53.5,102.3 53.25,102.05 47.75,102.05 47.4,102.4 47.4,103.9 47.2,104.1 44.35,104.1 44.15,103.9 44.15,96.1 45.2,95.05 47.1,95.05 47.3,95.25 47.3,96.1 47.15,96.25 44.95,96.25 44.75,96.45 44.75,98.45 45,98.7 47.1,98.7 47.25,98.55 47.25,98.3 47.4,98.15 51,98.15 51.2,97.95 51.2,93.95 51,93.75 50.45,93.75 50.35,93.65 50.35,92.65 50.45,92.55 50.8,92.55 50.95,92.4 50.95,90.85 50.75,90.65 50.2,90.65 50.05,90.5 50.05,89.75 50.2,89.6 52,89.6 52.3,89.3 52.3,87.15
  pour Top (isolate 0.305, no thermals): 55.25,118.25 55.25,124.15 55.4,124.3 56,124.3 56.6,124.9 56.6,127.95 56.7,128.05 60.25,128.05 60.3,128 60.3,126.6 60.4,126.5 66.8,126.5 66.9,126.4 66.9,124.15 66.8,124.05 65.3,124.05 65.15,123.9 65.15,121.45 64.7,121.45 64.7,123.05 64.6,123.15 59.15,123.15 59,123 59,119.25 59.25,119 74.85,119 75,119.15 75,125.05 74.85,125.2 68.15,125.2 68.05,125.3 68.05,125.8 68.15,125.9 70,125.9 70.6,126.5 70.6,127.4 70.7,127.5 76.35,127.5 76.5,127.65 76.5,139.35 76.35,139.5 56.5,139.5 56.5,140.6 108.05,140.6 109.1,139.55 109.1,120.25 108.3,119.45 94.65,119.45 94.4,119.2 94.4,113.05 94.25,112.9 92,112.9 91.9,113 91.9,114.35 91.75,114.5 89.5,114.5 89.4,114.6 89.4,115.05 89.5,115.15 90.9,115.15 91,115.25 91,118.9 91.1,119 91.8,119 92.2,119.4 92.2,120.45 91.85,120.8 89,120.8 88.8,120.6 88.8,120.1 88.65,119.95 81.55,119.95 81.4,120.1 81.4,123.35 81.55,123.5 88,123.5 88.85,124.35 88.85,129.45 88.2,130.1 85.25,130.1 84.5,129.35 84.5,127.85 84.2,127.55 83.25,127.55 82.55,126.85 82.55,125.5 82.35,125.3 80.15,125.3 79.6,124.75 79.6,109.85 79.3,109.55 69.05,109.55 69.05,111.8 78.65,111.8 78.85,112 78.85,118.35 78.45,118.75 61.49,118.75 60.89,118.15 55.35,118.15
  pour Top (isolate 0.305, no thermals): 81.4,107.75 81.4,93.7 81.25,93.55 77.45,93.55 77.3,93.4 77.3,91.25 77.45,91.1 78.2,91.1 78.3,91 78.3,90 78.2,89.9 73.85,89.9 73.8,89.95 73.8,94.4 73.9,94.5 75.8,94.5 75.9,94.6 75.9,94.7 76,94.8 77.9,94.8 78,94.9 78,95.25 78.05,95.3 78.45,95.3 78.6,95.45 78.6,96.9 78.7,97 79.95,97 80.1,97.15 80.1,98.95 79.95,99.1 78.6,99.1 78.5,99.2 78.5,100 78.6,100.1 79.95,100.1 80.1,100.25 80.1,102.45 79.95,102.6 78.35,102.6 78.3,102.65 78.3,107.75 78.35,107.8 81.35,107.8
  pour Top (isolate 0.305, no thermals): 76.5,111.8 75.75,111.8 75.6,111.95 75.6,117.2 75.5,117.3 63.1,117.3 62.9,117.1 62.9,108.3 62.6,108 60.55,108 60.55,87.2 60.65,87.1 68.1,87.1 68.15,87.15 68.15,90.65 68.1,90.7 66.5,90.7 66.35,90.85 66.35,92.85 66.25,92.95 62.65,92.95 62.5,93.1 62.5,97.35 62.65,97.5 63.5,97.5 63.6,97.6 63.6,100.35 63.55,100.4 60.9,100.4 60.9,102.55 61.05,102.7 63.5,102.7 63.6,102.8 63.6,105.35 63.5,105.45 61.05,105.45 60.9,105.6 60.9,107.5 61.1,107.7 64.6,107.7 64.75,107.55 64.75,100.05 64.8,100 65.75,100 65.8,100.05 65.8,106.6 65.95,106.75 68.65,106.75 68.65,107.85 66.75,107.85 66.6,108 66.6,111.7 66.5,111.8 63.6,111.8 63.35,112.05 63.35,116.65 63.6,116.9 73.95,116.9 73.95,112.05 73.7,111.8 73.1,111.8 73.1,110.85 76.5,110.85
  pour Top (isolate 0.305, no thermals): 68.2,117.05 68.2,116.9 68.65,116.9 69.35,116.2 73.6,116.2 73.95,115.85 73.95,115.55 75.6,115.55 75.6,117.05
  pour Top (isolate 0.305, no thermals): 61.2,79.15 79.15,79.15 79.15,78.55 76.2,78.55 75.9,78.25 75.9,77 76.2,76.7 76.7,76.7 76.8,76.6 76.8,70.7 75.9,69.8 75.9,64.45 75.4,63.95 71.1,63.95 70.85,63.7 70.85,62.9 70.75,62.8 64.4,62.8 64.4,63.1 70,63.1 70.35,63.45 70.35,64.7 70.1,64.95 68.9,64.95 68.65,64.7 68.65,64.35 68.55,64.25 63.85,64.25 63.75,64.35 63.75,66.75 63.55,66.95 62.85,66.95 62.75,67.05 62.75,75.25 62.95,75.45 63.45,75.45 63.7,75.7 63.7,76.9 63.45,77.15 62.95,77.15 62.75,77.35 62.75,78.35 62.55,78.55 61.2,78.55